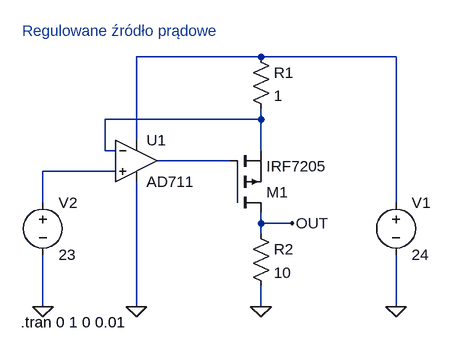
[diagram p0: schematic Controled_current_source.asc]
Controled_current_source.asc, the LTspice schematic file:
Version 4
SHEET 1 880 680
WIRE 320 -16 128 -16
WIRE 528 -16 320 -16
WIRE 320 80 320 64
WIRE 320 80 80 80
WIRE 128 112 128 -16
WIRE 80 128 80 80
WIRE 96 128 80 128
WIRE 320 128 320 80
WIRE 272 144 160 144
WIRE 96 160 -16 160
WIRE -16 208 -16 160
WIRE 528 208 528 -16
WIRE 320 240 320 224
WIRE 368 240 320 240
WIRE 320 256 320 240
WIRE -16 368 -16 288
WIRE 128 368 128 176
WIRE 320 368 320 336
WIRE 528 368 528 288
FLAG 320 368 0
FLAG 368 240 OUT
FLAG 528 368 0
FLAG 128 368 0
FLAG -16 368 0
SYMBOL res 304 -32 R0
SYMATTR InstName R1
SYMATTR Value 1
SYMBOL pmos 272 224 M180
SYMATTR InstName M1
SYMATTR Value IRF7205
SYMBOL res 304 240 R0
SYMATTR InstName R2
SYMATTR Value 10
SYMBOL voltage 528 192 R0
WINDOW 123 0 0 Left 0
WINDOW 39 0 0 Left 0
SYMATTR InstName V1
SYMATTR Value 24
SYMBOL OpAmps\\AD711 128 80 R0
SYMATTR InstName U1
SYMBOL voltage -16 192 R0
WINDOW 123 0 0 Left 0
WINDOW 39 0 0 Left 0
SYMATTR InstName V2
SYMATTR Value 23
TEXT -48 -56 Left 2 ;Regulowane źródło prądowe
TEXT -50 392 Left 2 !.tran 0 1 0 0.01

The netlist it stands for:
* Controled_current_source.asc
R1 N001 N002 1
M1 OUT N003 N002 N002 IRF7205
R2 OUT 0 10
V1 N001 0 24
XU1 N004 N002 N001 0 N003 AD712  ; AD711, pins In+ In- V+ V- OUT
V2 N004 0 23
.model NMOS NMOS
.model PMOS PMOS
.lib standard.mos
* Regulowane źródło prądowe
.tran 0 1 0 0.01
.lib ADI1.lib
.backanno
.end